# Altium schematic sheet Sheet3.SchDoc
size A; DrawnBy: Senuda Ratnayake; SheetNumber: 1; SheetTotal: 1
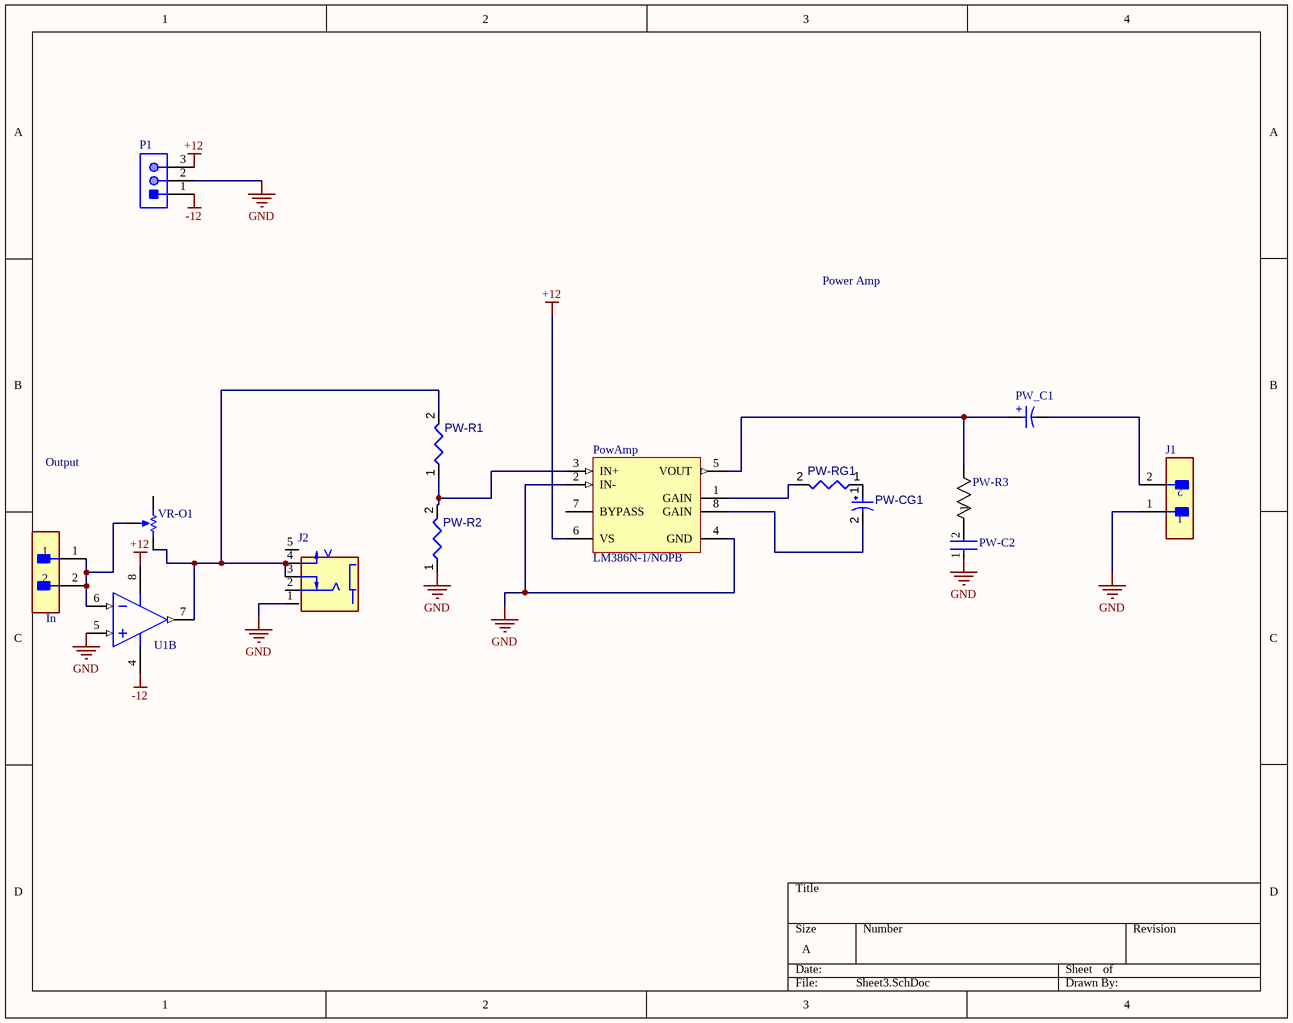
[diagram p0: Sheet3.SchDoc]

## Parts
In  TMM-102-03-F-S  [FP-TMM-102-03-F-S-MFG]  (value not drawn)
J1  TMM-102-03-F-S  [FP-TMM-102-03-F-S-MFG]  (value not drawn)
J2  35RAPC4BH3  [SWITCHCRAFT_35RAPC4BH3]  (value not drawn)
P1  B3P-VH(LF)(SN)  [JST-B3P-VH(LF)(SN)-3_V]  (value not drawn)
PowAmp  LM386N-1/NOPB  [P0008A]
PW-C2  VY2102M29Y5US6TV7  [FP-VY2102M29Y5US6TV7-MFG]  (value not drawn)
PW-CG1  ECA1HM100  [CAPPR55-200-1100X500X1200]  (value not drawn)
PW-R1  MFR-25FBF52-2K21  [RESA60-630X240]  (value not drawn)
PW-R2  MFR-25FBF52-2K21  [RESA60-630X240]  (value not drawn)
PW-R3  AC01000001000JA100  [RES_AC01_VIS]  (value not drawn)
PW-RG1  MFR-25FBF52-2K21  [RESA60-630X240]  (value not drawn)
PW_C1  860240478010  [WCAP-AT1H_D13H25]  (value not drawn)
U1  NE5532P  [P0008A]  (value not drawn)  (part B of 2)
VR-O1  3852A-282-103AL  [BOUR-3852A-282-103AL-3_V]  (value not drawn)

## Nets
+12: P1.3 PowAmp.6(VS) U1.8(VCC+)
-12: P1.1 U1.4(VCC-)
GND: J1.1 J2.1 P1.2 PowAmp.2(IN-) PowAmp.4(GND) PW-C2.1 PW-R2.1 U1.5(IN2+)
NetIn_1: In.1 In.2 U1.6(IN2-) VR-O1.2(S)
NetJ1_2: J1.2 PW_C1.2(N)
NetJ2_3: J2.3 J2.4 PW-R1.2 U1.7(OUT2) VR-O1.3(CW)
NetPowAmp_1: PowAmp.1(GAIN) PW-RG1.2
NetPowAmp_3: PowAmp.3(IN+) PW-R1.1 PW-R2.2
NetPowAmp_5: PowAmp.5(VOUT) PW-R3.2 PW_C1.1(P)
NetPowAmp_8: PowAmp.8(GAIN) PW-CG1.2
NetPW-C2_2: PW-C2.2 PW-R3.1
NetPW-CG1_1: PW-CG1.1 PW-RG1.1

Not connected (* = marked no-connect by the designer): J2 2 5; PowAmp 7(BYPASS); VR-O1 1(CCW)

## Notes on the sheet
- Power Amp
- Output
- (in symbol CMP-03913-54218176-1) +

## Library data of the parts
In J1 = CMP-02766-001614-1: CONN HEADER VERT 2POS 2MM; Number of Contacts: 2; Gender: Male; Pitch: 2mm; Packaging: Bulk; RoHS Compliant: Yes; Termination: Solder; Contact Plating: Gold; Mount: Through Hole; Number of Rows: 1; Radiation Hardening: No; Lead Free: Lead Free
J2 = 35RAPC4BH3: PC horizontal mount Jack stereo threaded bushing 3.5MM, 35 Series | Switchcraft 35RAPC4BH3; MF: Switchcraft Inc.; SnapEDA_Link: https://www.snapeda.com/parts/35RAPC4BH3/SWITCHCRAFT/view-part/?ref=snap; Package: None; Value: *; MP: 35RAPC4BH3; Check_prices: https://www.snapeda.com/parts/35RAPC4BH3/SWITCHCRAFT/view-part/?ref=eda
P1 = CMP-002-00026-2: Male Header, Pitch 3.96 mm, 1 x 3 Position, Height 10.9 mm, Tail Length 3.7 mm, -25 to 85 degC, RoHS, Bulk; Manufacturer: JST; Case/Package: B3P-VH(LF)(SN); Connector Type: Header; Datasheet Version: May-16; Mounting Technology: TH; Package Description: Male Header, Pitch 3.96 mm, 1 x 3 Position, Height 10.9 mm, Tail Length 3.7 mm; Gender: Male; Manufacturer URL: http://www.jst.com/home2.html; Package Reference: B3P-VH(LF)(SN); Datasheet URL: http://www.jst-mfg.com/product/pdf/eng/eVH.pdf; Min Operating Temperature: -25°C; Max Operating Temperature: 85°C; RoHS Compliant: Unknown
PowAmp = CMP-0057-00052-4: Low Voltage Audio Power Amplifier, 8-pin MDIP, Pb-Free; Manufacturer: Texas Instruments; PackageTopMarking: NSUZXYTTE#*LM*386N-1; PowerWise: N; CompType: Audio IC; RoHS: Y; PackageReference: P0008A; Code_JEDEC: MS-001-BA; PackageDescription: MDIP, .365 x .250 x .130in, 8 Lead, .100in Pitch; PinCount: 8; ComponentLink1URL: http://www.ti.com/general/docs/lit/getliterature.tsp?genericPartNumber=LM386&fileType=pdf; ComponentLink1Description: Datasheet URL
PW-C2 = CMP-00030-42817980-1: VY2102M29Y5US6TV7 Cap Ceramic Suppression X1/Y2 0.001uF 440VAC/300VAC Y5U 20% (7.5 X 5mm) Radial 7.5mm 125C T/R; Capacitance: 1nF; Lead/Base Style: Kinked; Lead Diameter: 600µm; Voltage: 300V; Voltage Rating: 1kV; Case/Package: Radial; Height: 10.5mm; REACH SVHC: Unknown; Packaging: Tape & Reel (TR); Lead Free: Lead Free; RoHS: Compliant; Min Operating Temperature: -40°C; Max Operating Temperature: 125°C; Termination: Radial; Composition: Ceramic; Depth: 5mm; Dielectric: Y5U; Diameter: 7.5mm; Lead Pitch: 7.5mm; Schedule B: 8532230060, 8532230060; Radiation Hardening: No; Tolerance: 20%; Height - Seated (Max): 11.5062mm; Voltage Rating (AC): 300V; Material: Ceramic; Mount: Through Hole; NexarPartId: 42817980
PW-CG1 = CMP-001-00025-7: Aluminum Electrolytic Capacitor, 10 uF, +/- 20%, 50 V, -40 to 85 degC, 2-Pin THD, RoHS, Bulk; Manufacturer: Panasonic; Ripple Current (AC): 65mA; Voltage Rating: 50V; Value: 10µF; Mounting Technology: TH; RoHS Compliant: True; Capacitor Type: Electrolytic; Datasheet Version: Rev. 05, 10/2016; Min Operating Temperature: -40°C; Packaging: Bulk; Ripple Current: 65mA; Tolerance: 20%; Max Operating Temperature: 85°C; Datasheet URL: https://industrial.panasonic.com/cdbs/www-data/pdf/RDF0000/ABA0000C1218.pdf; Lead Pitch: 2mm; Pins: 2; Diameter: 5mm; Manufacturer URL: http://www.panasonic.com/; Package Reference: CAPPR55-200-1100X500X1200; Package Description: 2-Pin Radial Lead, Dia 5 mm, Height 12 mm; Case/Package: Radial; Package Quantity: 200
PW-R1 PW-R2 PW-RG1 = CMP-009-00054-4: Axial Resistor, 2.21 KOhm, +/- 1%, 0.25 W, -55 to 155 degC, 2-Pin THD, RoHS, Bulk; Manufacturer: Yageo; Voltage Rating: 250V; Power: 250mW; Value: 2.21k; Tolerance: 1%; Package Reference: MFR-25; Packaging: Bulk; Datasheet Version: Apr-13; Manufacturer URL: http://www.yageo.com/; Package Description: 2-Pin Axial Lead, Dia 2.4 mm, Body Length 6.3 mm; Mounting Technology: TH; RoHS Compliant: True; Package Quantity: 200; Min Operating Temperature: -55°C; Case/Package: Axial; Max Operating Temperature: 155°C; Datasheet URL: http://www.yageo.com/documents/recent/Yageo%20LR_MFR_2013.pdf
PW-R3 = CMP-T1-00030-41941199_01-5: VISHAY AC01000001000JA100 Through Hole Resistor, 100 ohm, Axial Leaded, 1 W, 5%, AC Series; Voltage Rating (DC): 10V; Power Rating: 1W; Resistance: 100Ω; Temperature Coefficient: 180ppm/°C; Lead Diameter: 800µm; Min Operating Temperature: -40°C; RoHS: Compliant; Number of Pins: 2; Contact Plating: Tin; Voltage Rating: 10V; Number of Terminations: 2; Packaging: Cut Tape (CT); REACH SVHC: Unknown; Schedule B: 8533210080, 8533210080; Diameter: 4.3mm; Tolerance: 5%; Features: Flame Retardant Coating; Max Operating Temperature: 275°C; Composition: Metal Film, Wirewound; Mount: Through Hole; Max Power Dissipation: 1W; Length: 11mm; Termination: Axial; Lead Free: Lead Free; Case/Package: Conformal; Military Standard: Not; NexarPartId: 41941199
PW_C1 = CMP-03913-54218176-1: 860240478010 WCAP-AT1H Aluminum Electrolytic Capacitors; Ripple Current: 1.552A; Voltage Rating: 25V; Life (Hours): 10000hours; Leakage Current: 250µA; Pitch: 5mm; Capacitance: 1mF; Tolerance: 20%; Polarity: Polar; RoHS: Compliant; Packaging: Tape & Box (TB); Max Operating Temperature: 105°C; Height - Seated (Max): 26.4922mm; NexarPartId: 54218176; Case/Package: Radial; Lead Pitch: 5.0038mm; Diameter: 13mm; Mount: Through Hole; Length: 25mm; Min Operating Temperature: -40°C
U1 = CMP-0017-00910-2: Dual Low-Noise High-Speed Audio Operational Amplifier, 10 to 30 V, 0 to 70 degC, 8-pin DIP (P8), Pb-Free (RoHS); Manufacturer: Texas Instruments; Iq per channel(Max)(mA): 4; Slew Rate(Typ)(V/us): 9; Vn at 1kHz(Typ)(nV/rtHz): 5; IIB(Max)(pA): 800000; Total Supply Voltage(Max)(+5V is 5, +/-5V is 10): 30; GBW(Typ)(MHz): 10; CMRR(Min)(dB): 70; Number of Channels: 2; Sub Family: General Purpose Amplifier, High Supply Voltage Amplifier (>=30V), Low Noise Amp (<=10nV/rtHz); ComponentLink2URL: http://www.ti.com/lit/ds/symlink/ne5532.pdf; PackageReference: P0008A; PackageDescription: 8-Pin Plastic In-Line, Body 9.59 x 6.35 mm, Pitch 2.54 mm; ComponentLink1Description: Manufacturer URL; Eco-Plan: Pb-Free (RoHS); Mounting Technology: Through Hole; Code_JEDEC: MS-001; PackageVersion: 4040082/E, 04/2010; DatasheetVersion: SLOS075I; ComponentLink3URL: http://www.ti.com/litv/pdf/mpdi001b; ComponentLink2Description: Datasheet; Vio (25C)(Max)(mV): 4; PartNumber: NE5532P; ComponentLink3Description: Package Specification; Total Supply Voltage(Min)(+5V is 5, +/-5V is 10): 10; ComponentLink1URL: http://www.ti.com/
VR-O1 = CMP-2000-05079-1: Diameter Panel Control, 10 KOhm, +/- 10%, 2 W, -1 to 125 degC, 3-Pin THD, RoHS, Bulk; Manufacturer: Bourns; Temperature Coefficient: ±150ppm/degC; Number of Gangs: 1; Other Names: 3852A282103AL; Actuator Length: 0.875"(22.23mm); Resistive Material: Cermet; PCN Design/Specification: PBTResinJun/2011; Rotation: 280deg; PCN Other: MultipleChanges01/Dec/2012; Catalog Drawings: 3852SeriesSide1 / 3852SeriesSide2; Online Catalog: 3852and3856Series; Associated Product: 36-8560-ND / -KNOBINSTRUMW/DIALRND.9"DIA / 36-8555-ND / -KNOBINSTRUMSKIRTEDRND.7"DIA / 36-8556-ND / -KNOBINSTRUMSKIRTEDRND.9"DIA / 36-8565-ND / -KNOBINSTRUMDBLBARRND.7"DIA / 36-8566-ND / -KNOBINSTRUMDBLBARRND.9"DIA / 36-8568-ND / -KNOBINSTRUMSGLBARRND.7"DIA / 36-8569-ND / -KNOBINSTRUMSGLBARRND.9"DIA / 36-8559-ND / -KNOBINSTRUMW/DIALRND.7"DIA / 226-1006-ND / -KNOBBLKGLOSS.75"DIA.250"SHAFT / 226-1007-ND / -KNOBBLKGLOSS.925"DIA.250"SHAFT / 226-1011-ND / -KNOBBLKGLOS; Actuator Diameter: 0.250"(6.35mm); Built in Switch: None; Resistance (Ohms): 10k; Power (Watts): 2W; Actuator Type: Slotted; Standard Package: 45; Tolerance: ±10%; Taper: Linear; Series: 3852; Packaging: Bulk; Category: Potentiometers,VariableResistors; Bushing Thread: 3/8-32; Datasheet URL: https://datasheet.ciiva.com/11831/0900766b80f93b4b-11831016.pdf; Datasheet Version: Sep-14; Number of Turns: 1; Family: RotaryPotentiometers,Rheostats; Termination Style: SolderLug; RoHS Information: 3852A-LMaterialDeclaration; Mounting Type: PanelMount; Manufacturer URL: http://www.bourns.com/